# EAGLE design TMC2660-test-with-grbl2 (EAGLE 7.5.0)

## Sheet 1 of 2
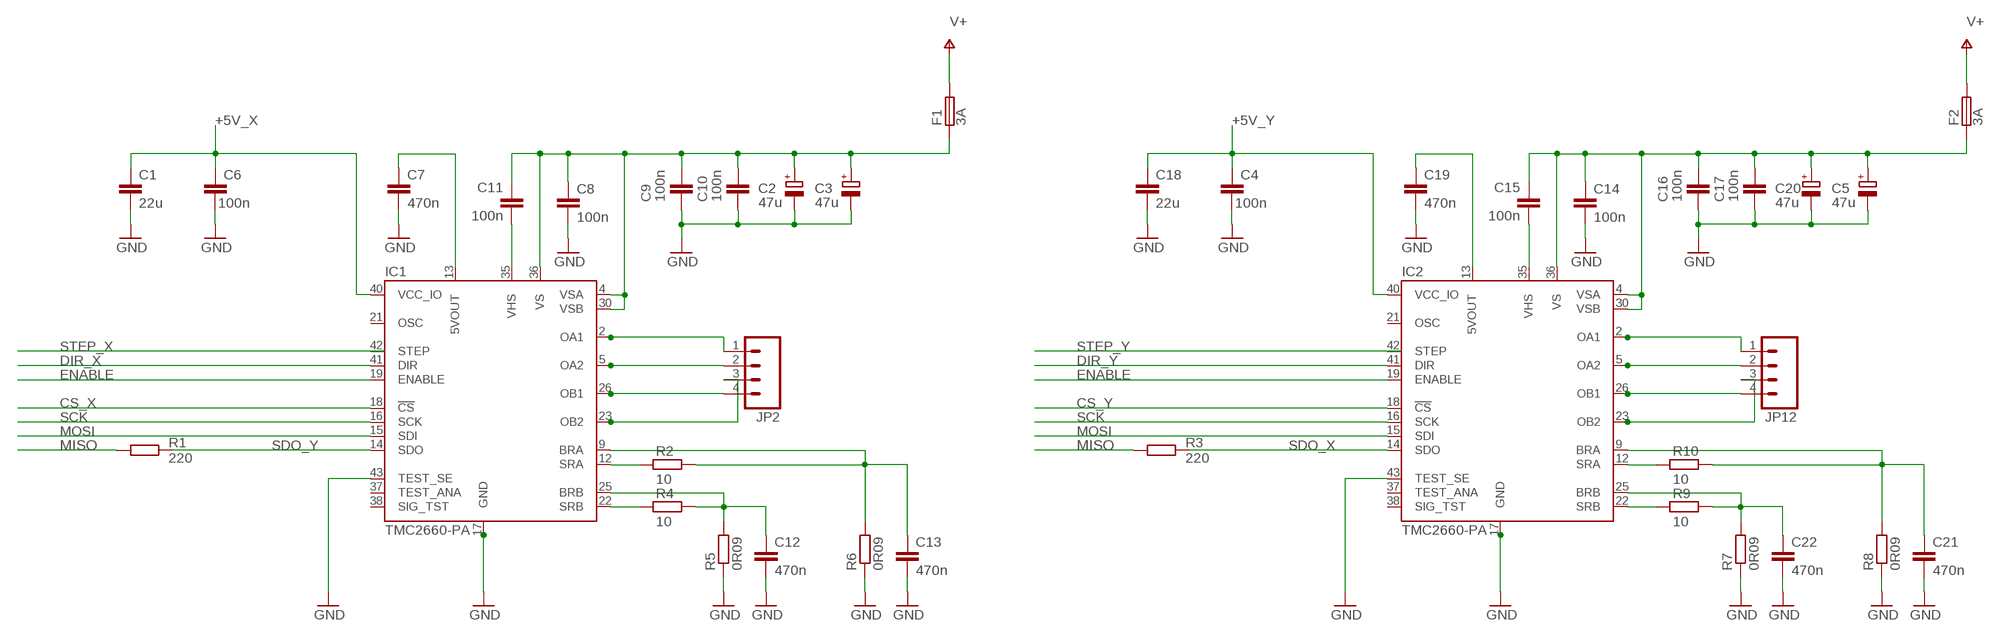
[diagram p0: schematic, sheet 1, part 1 of 2]
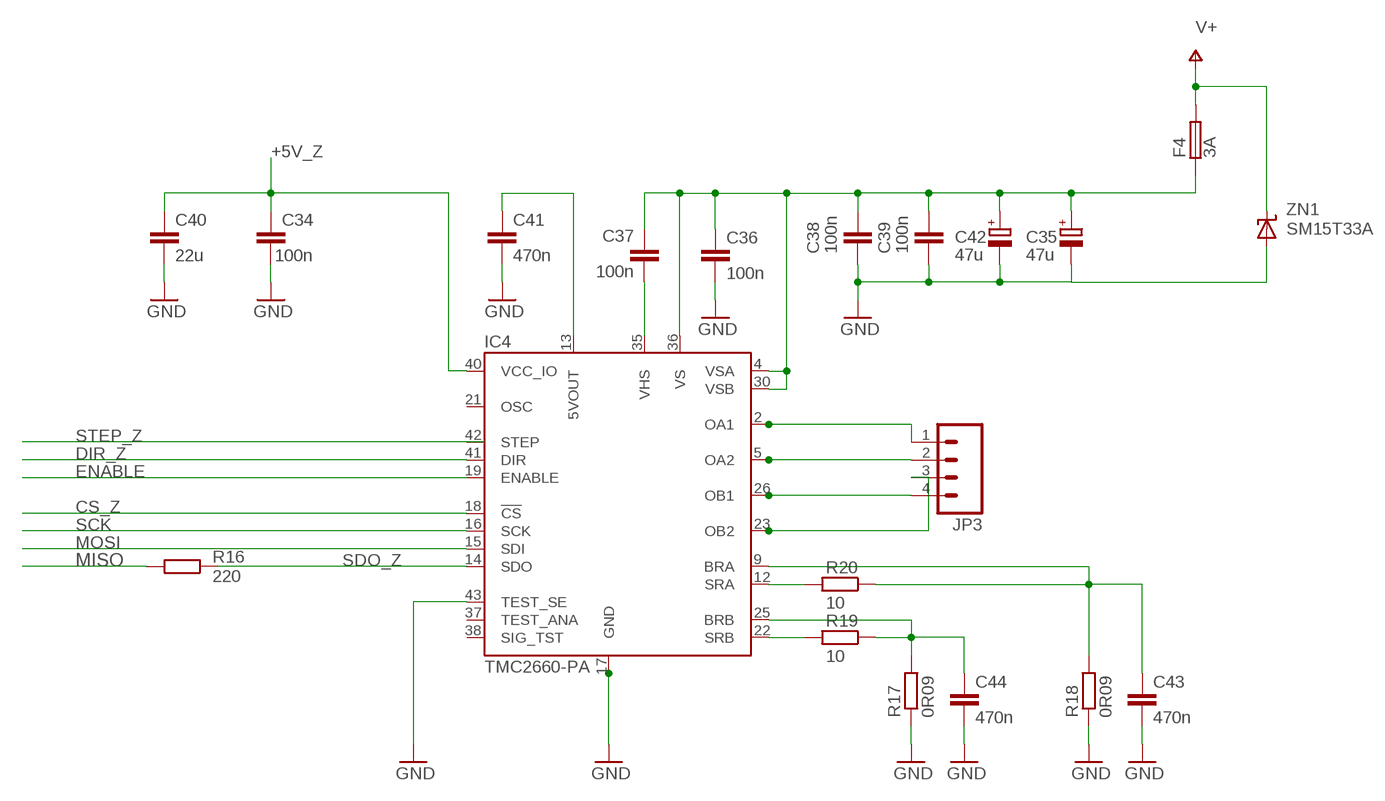
[diagram p1: schematic, sheet 1, part 2 of 2]

### Parts
C1  22u  C-EUC1206  [C1206]
C2  47u  CPOL-EUE5-8.5  [E5-8,5]
C3  47u  CPOL-EUE5-8.5  [E5-8,5]
C4  100n  C-EUC1206K  [C1206K]
C5  47u  CPOL-EUE5-8.5  [E5-8,5]
C6  100n  C-EUC1206K  [C1206K]
C7  470n  C-0805W  [0805-WIDE]
C8  100n  C-EUC0603K  [C0603K]
C9  100n  C-EUC0603K  [C0603K]
C10  100n  C-EUC0603K  [C0603K]
C11  100n  C-EUC0603K  [C0603K]
C12  470n  C-0805W  [0805-WIDE]
C13  470n  C-0805W  [0805-WIDE]
C14  100n  C-EUC0603K  [C0603K]
C15  100n  C-EUC0603K  [C0603K]
C16  100n  C-EUC0603K  [C0603K]
C17  100n  C-EUC0603K  [C0603K]
C18  22u  C-EUC1206  [C1206]
C19  470n  C-0805W  [0805-WIDE]
C20  47u  CPOL-EUE5-8.5  [E5-8,5]
C21  470n  C-0805W  [0805-WIDE]
C22  470n  C-0805W  [0805-WIDE]
C34  100n  C-EUC1206K  [C1206K]
C35  47u  CPOL-EUE5-8.5  [E5-8,5]
C36  100n  C-EUC0603K  [C0603K]
C37  100n  C-EUC0603K  [C0603K]
C38  100n  C-EUC0603K  [C0603K]
C39  100n  C-EUC0603K  [C0603K]
C40  22u  C-EUC1206  [C1206]
C41  470n  C-0805W  [0805-WIDE]
C42  47u  CPOL-EUE5-8.5  [E5-8,5]
C43  470n  C-0805W  [0805-WIDE]
C44  470n  C-0805W  [0805-WIDE]
F1  3A  AF2-FUSE_AF  [AF2]
F2  3A  AF2-FUSE_AF  [AF2]
F4  3A  AF2-FUSE_AF  [AF2]
IC1  TMC2660-PA  [PQFP44]
IC2  TMC2660-PA  [PQFP44]
IC4  TMC2660-PA  [PQFP44]
JP2  M04SCREW  [SCREWTERMINAL-3.5MM-4]
JP3  M04SCREW  [SCREWTERMINAL-3.5MM-4]
JP12  M04SCREW  [SCREWTERMINAL-3.5MM-4]
R1  220  R-EU_R0603  [R0603]
R2  10  R-EU_R0603  [R0603]
R3  220  R-EU_R0603  [R0603]
R4  10  R-EU_R0603  [R0603]
R5  0R09  R-EU_R1206  [R1206]
R6  0R09  R-EU_R1206  [R1206]
R7  0R09  R-EU_R1206  [R1206]
R8  0R09  R-EU_R1206  [R1206]
R9  10  R-EU_R0603  [R0603]
R10  10  R-EU_R0603  [R0603]
R16  220  R-EU_R0603  [R0603]
R17  0R09  R-EU_R1206  [R1206]
R18  0R09  R-EU_R1206  [R1206]
R19  10  R-EU_R0603  [R0603]
R20  10  R-EU_R0603  [R0603]
ZN1  SM15T33A  D-ZN_SMC  [SMC]

### Nets
+5V_X: C1.1 C6.2 IC1.40(VCC_IO)
+5V_Y: C4.2 C18.1 IC2.40(VCC_IO)
+5V_Z: C34.2 C40.1 IC4.40(VCC_IO)
CS_X: IC1.18(!CS) ; also sheet 2
CS_Y: IC2.18(!CS) ; also sheet 2
CS_Z: IC4.18(!CS) ; also sheet 2
DIR_X: IC1.41(DIR) ; also sheet 2
DIR_Y: IC2.41(DIR) ; also sheet 2
DIR_Z: IC4.41(DIR) ; also sheet 2
ENABLE: IC1.19(ENABLE) IC2.19(ENABLE) IC4.19(ENABLE)
GND: C1.2 C2.- C3.- C4.1 C5.- C6.1 C7.2 C8.2 C9.1 C10.1 C12.2 C13.2 C14.2 C16.1 C17.1 C18.2 C19.2 C20.- C21.2 C22.2 C34.1 C35.- C36.2 C38.1 C39.1 C40.2 C41.2 C42.- C43.2 C44.2 IC1.17(GND) IC1.39(GND1) IC1.43(TEST_SE) IC1.44(GND2) IC2.17(GND) IC2.39(GND1) IC2.43(TEST_SE) IC2.44(GND2) IC4.17(GND) IC4.39(GND1) IC4.43(TEST_SE) IC4.44(GND2) R5.1 R6.1 R7.1 R8.1 R17.1 R18.1 ZN1.P$2(A) ; also sheet 2
MISO: R1.2 R3.2 R16.2 ; also sheet 2
MOSI: IC1.15(SDI) IC2.15(SDI) IC4.15(SDI) ; also sheet 2
N$1: IC1.22(SRB) R4.2
N$2: C12.1 IC1.25(BRB) R4.1 R5.2
N$3: C13.1 IC1.9(BRA) R2.1 R6.2
N$4: IC1.12(SRA) R2.2
N$5: C22.1 IC2.25(BRB) R7.2 R9.1
N$6: C21.1 IC2.9(BRA) R8.2 R10.1
N$7: IC2.22(SRB) R9.2
N$8: IC2.12(SRA) R10.2
N$9: C44.1 IC4.25(BRB) R17.2 R19.1
N$10: C43.1 IC4.9(BRA) R18.2 R20.1
N$11: IC4.22(SRB) R19.2
N$12: IC4.12(SRA) R20.2
OA1: IC1.2(OA1) IC1.3(OA1_1) IC1.7(OA1_2) IC1.8(OA1_3) JP2.1
OA2: IC1.5(OA2) IC1.6(OA2_1) IC1.10(OA2_2) IC1.11(OA2_3) JP2.2
OA3: IC2.2(OA1) IC2.3(OA1_1) IC2.7(OA1_2) IC2.8(OA1_3) JP12.1
OA4: IC2.5(OA2) IC2.6(OA2_1) IC2.10(OA2_2) IC2.11(OA2_3) JP12.2
OA5: IC4.2(OA1) IC4.3(OA1_1) IC4.7(OA1_2) IC4.8(OA1_3) JP3.1
OA6: IC4.5(OA2) IC4.6(OA2_1) IC4.10(OA2_2) IC4.11(OA2_3) JP3.2
OB1: IC1.26(OB1) IC1.27(OB1_1) IC1.31(OB1_2) IC1.32(OB1_3) JP2.4
OB2: IC1.23(OB2) IC1.24(OB2_1) IC1.28(OB2_2) IC1.29(OB2_3) JP2.3
OB3: IC2.23(OB2) IC2.24(OB2_1) IC2.28(OB2_2) IC2.29(OB2_3) JP12.3
OB4: IC2.26(OB1) IC2.27(OB1_1) IC2.31(OB1_2) IC2.32(OB1_3) JP12.4
OB5: IC4.23(OB2) IC4.24(OB2_1) IC4.28(OB2_2) IC4.29(OB2_3) JP3.3
OB6: IC4.26(OB1) IC4.27(OB1_1) IC4.31(OB1_2) IC4.32(OB1_3) JP3.4
PWR_X: C2.+ C3.+ C8.1 C9.2 C10.2 C11.2 F1.P$1 IC1.4(VSA) IC1.30(VSB) IC1.36(VS)
PWR_Y: C5.+ C14.1 C15.2 C16.2 C17.2 C20.+ F2.P$1 IC2.4(VSA) IC2.30(VSB) IC2.36(VS)
PWR_Z: C35.+ C36.1 C37.2 C38.2 C39.2 C42.+ F4.P$1 IC4.4(VSA) IC4.30(VSB) IC4.36(VS)
SCK: IC1.16(SCK) IC2.16(SCK) IC4.16(SCK) ; also sheet 2
SDO_X: IC2.14(SDO) R3.1
SDO_Y: IC1.14(SDO) R1.1
SDO_Z: IC4.14(SDO) R16.1
STEP_X: IC1.42(STEP) ; also sheet 2
STEP_Y: IC2.42(STEP) ; also sheet 2
STEP_Z: IC4.42(STEP) ; also sheet 2
V+: F1.P$2 F2.P$2 F4.P$2 ZN1.P$1(C) ; also sheet 2
VHS: C11.1 IC1.35(VHS)
VHS1: C15.1 IC2.35(VHS)
VHS2: C37.1 IC4.35(VHS)
VREG: C7.1 IC1.13(5VOUT)
VREG1: C19.1 IC2.13(5VOUT)
VREG2: C41.1 IC4.13(5VOUT)
Unconnected: IC1.21(OSC) IC1.37(TEST_ANA) IC1.38(SIG_TST) IC2.21(OSC) IC2.37(TEST_ANA) IC2.38(SIG_TST) IC4.21(OSC) IC4.37(TEST_ANA) IC4.38(SIG_TST)

## Sheet 2 of 2
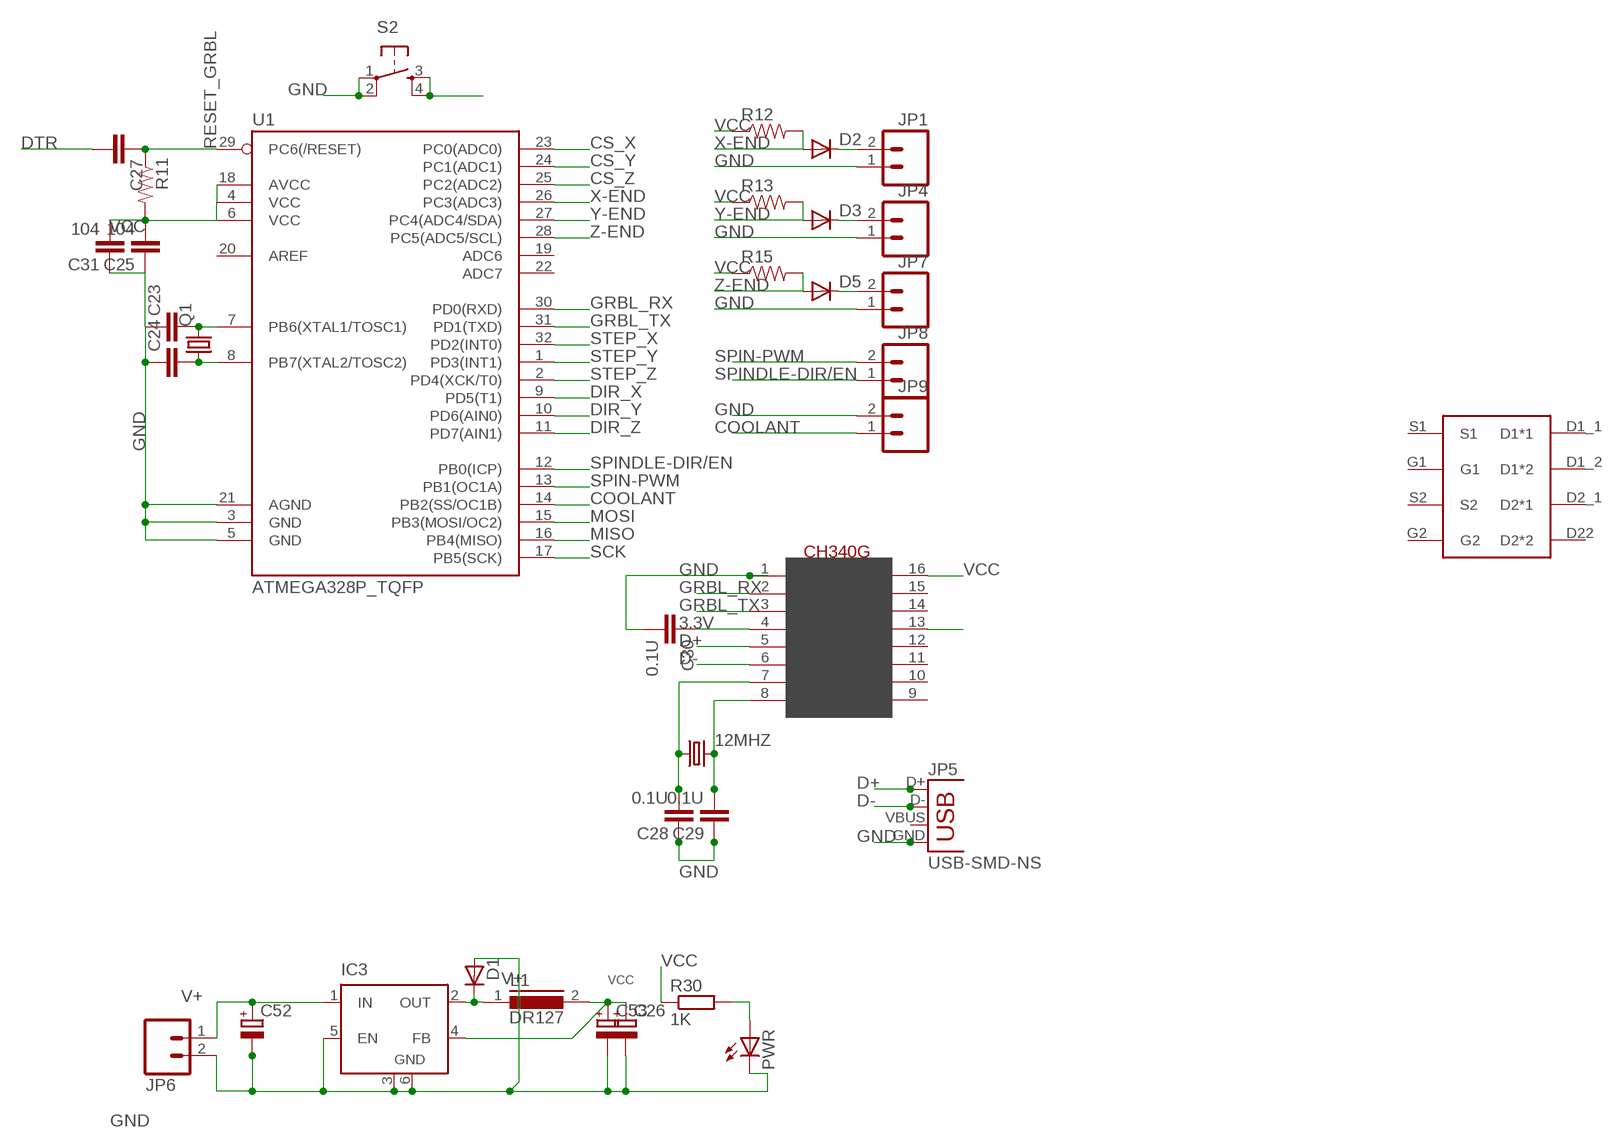
[diagram p2: schematic, sheet 2]

### Parts
12MHZ  CRYSTALHC49UP  [HC49UP]
C23  CAP1206  [1206]
C24  CAP1206  [1206]
C25  104  CAP1206  [1206]
C26  CPOL-EUE2.5-6  [E2,5-6]
C27  CAP1206  [1206]
C28  0.1U  C-EUC1206  [C1206]
C29  0.1U  C-EUC1206  [C1206]
C30  0.1U  C-EUC1206  [C1206]
C31  104  CAP1206  [1206]
C52  CPOL-EUE5-8.5  [E5-8,5]
C53  CPOL-EUE5-8.5  [E5-8,5]
D1  D-SOD-80  [SOD80]
D2  DIODESMB  [SMB-DIODE]
D3  DIODESMB  [SMB-DIODE]
D5  DIODESMB  [SMB-DIODE]
IC3  LM2596S  [TO263-5]
JP1  M023.5MM  [SCREWTERMINAL-3.5MM-2]
JP4  M023.5MM  [SCREWTERMINAL-3.5MM-2]
JP5  USB-SMD-NS  [USB-MINIB-NOSTOP]
JP6  M023.5MM  [SCREWTERMINAL-3.5MM-2]
JP7  M023.5MM  [SCREWTERMINAL-3.5MM-2]
JP8  M023.5MM  [SCREWTERMINAL-3.5MM-2]
JP9  M023.5MM  [SCREWTERMINAL-3.5MM-2]
L1  DR127  [DR127]
PWR  LEDCHIPLED_1206  [CHIPLED_1206]
Q1  CRYSTALHC49UP  [HC49UP]
R11  RESISTOR1206  [1206]
R12  RESISTOR1206  [1206]
R13  RESISTOR1206  [1206]
R15  RESISTOR1206  [1206]
R30  1K  R-EU_M1206  [M1206]
S2  TAC_SWITCHSMD  [TACTILE_SWITCH_SMD]
U1  ATMEGA328P_TQFP  [TQFP32-08]
U$3  CSD88537ND  [CSD88537ND]
U$4  CH340G  [SOIC16]

### Nets
3.3V: C30.1 U$4.4(V3)
COOLANT: JP9.1 U1.14(PB2(SS/OC1B))
CS_X: U1.23(PC0(ADC0)) ; also sheet 1
CS_Y: U1.24(PC1(ADC1)) ; also sheet 1
CS_Z: U1.25(PC2(ADC2)) ; also sheet 1
D+: JP5.D+ U$4.5(D+)
D-: JP5.D- U$4.6(D-)
DIR_X: U1.9(PD5(T1)) ; also sheet 1
DIR_Y: U1.10(PD6(AIN0)) ; also sheet 1
DIR_Z: U1.11(PD7(AIN1)) ; also sheet 1
DTR: C27.2 U$4.13(DTR)
GND: C23.1 C24.1 C25.1 C26.- C28.1 C29.1 C30.2 C31.1 C52.- C53.- D1.2(A) IC3.3(GND) IC3.5(EN) IC3.6(GND) JP1.1 JP4.1 JP5.GND JP6.2 JP7.1 JP9.2 PWR.C S2.1 S2.2 U1.3(GND) U1.5(GND) U1.21(AGND) U$4.1(GND) ; also sheet 1
GRBL_RX: U1.30(PD0(RXD)) U$4.2(TX)
GRBL_TX: U1.31(PD1(TXD)) U$4.3(RX)
MISO: U1.16(PB4(MISO)) ; also sheet 1
MOSI: U1.15(PB3(MOSI/OC2)) ; also sheet 1
N$13: C23.2 Q1.2 U1.7(PB6(XTAL1/TOSC1))
N$14: C24.2 Q1.1 U1.8(PB7(XTAL2/TOSC2))
N$15: D2.C JP1.2
N$16: D3.C JP4.2
N$17: 12MHZ.1 C28.2 U$4.7(XI)
N$18: D5.C JP7.2
N$19: 12MHZ.2 C29.2 U$4.8(XO)
N$45: D1.1(C) IC3.2(OUT) L1.1
N$47: PWR.A R30.2
RESET_GRBL: C27.1 R11.1 S2.3 S2.4 U1.29(PC6(/RESET))
SCK: U1.17(PB5(SCK)) ; also sheet 1
SPIN-PWM: JP8.2 U1.13(PB1(OC1A))
SPINDLE-DIR/EN: JP8.1 U1.12(PB0(ICP))
STEP_X: U1.32(PD2(INT0)) ; also sheet 1
STEP_Y: U1.1(PD3(INT1)) ; also sheet 1
STEP_Z: U1.2(PD4(XCK/T0)) ; also sheet 1
V+: C52.+ IC3.1(IN) JP6.1 ; also sheet 1
VCC: C25.2 C26.+ C31.2 C53.+ IC3.4(FB) L1.2 R11.2 R12.1 R13.1 R15.1 R30.1 U1.4(VCC) U1.6(VCC) U1.18(AVCC) U$4.16(VCC)
X-END: D2.A R12.2 U1.26(PC3(ADC3))
Y-END: D3.A R13.2 U1.27(PC4(ADC4/SDA))
Z-END: D5.A R15.2 U1.28(PC5(ADC5/SCL))
Unconnected: JP5.VBUS U1.19(ADC6) U1.20(AREF) U1.22(ADC7) U$4.9(CTS) U$4.10(DSR) U$4.11(RI) U$4.12(DCD) U$4.14(RTS) U$4.15(RS232)

## Power pins joined to a net without a drawn wire
D1*1: U$3.D1_1(D1*1)
D1*2: U$3.D1_2(D1*2)
D2*1: U$3.D2_1(D2*1)
D2*2: U$3.D22(D2*2)
G1: U$3.G1
G2: U$3.G2
S1: U$3.S1
S2: U$3.S2

## Library data of the parts
12MHZ = crystal:CRYSTAL: CRYSTAL; OC_FARNELL: unknown; OC_NEWARK: unknown
C1 C18 C40 = rcl:C-EU: CAPACITOR, European symbol; MANUFACTURER: Taiyo Yuden; PARTNR: JMK316B7226ML-T; TYPE: X7R; VOLTAGE: 6.3V
C2 C3 C5 C20 C35 C42 = rcl:CPOL-EU: POLARIZED CAPACITOR, European symbol; MANUFACTURER: PANASONIC; PARTNR: EEEFK1H470XP; VOLTAGE: 50V
C4 C6 C34 = rcl:C-EU: CAPACITOR, European symbol; MANUFACTURER: Kemet; PARTNR: C0603C104K3RACTU; TYPE: X7R; VOLTAGE: 25V
C7 C12 C13 C19 C21 C22 C41 C43 C44 = 07_eigene_RLC:C; MANUFACTURER: Vishay; PARTNR: VJ0805Y474KXQTW1BC; TYPE: X7R; VOLTAGE: 10V
C8-C11 C14-C17 C36-C39 = rcl:C-EU: CAPACITOR, European symbol; MANUFACTURER: Kemet; PARTNR: C0603C104K5RACTU; TYPE: X7R; VOLTAGE: 50V
C23-C25 C27 C31 = SparkFun-Capacitors:CAP: Capacitor Standard 0603 ceramic capacitor, and 0.1" leaded capacitor.
C26 C52 C53 = resistor:CPOL-EU: POLARIZED CAPACITOR, European symbol
C28-C30 = rcl:C-EU: CAPACITOR, European symbol
D1 = semicon-smd-ipc:D-: DIODE unfilled
D2 D3 D5 = SparkFun-DiscreteSemi:DIODE: Diode These are standard reverse protection diodes and small signal diodes. SMA package can handle up to about 1A. SOD-323 can handle about 200mA. What the SOD-323 package when ordering, there are some mfgs out there that are 5-pin packages.
F1 F2 F4 = 02_eigene:AF2-FUSE: AF2 Very Fast Acting Surface Mount Fuses Konrad Meyer (c) 2011 Very fast acting at 200% overload current levels ? Excellent inrush current withstanding capability ? Fiberglass enforced epoxy fuse body ? Copper or copper alloy composite fuse link ? Copper termination with nickel and tin plating ? Halogen free, RoHS compliant and 100% lead-free ? Operating temperature range: -55°C to +125 °C (with de-rating) www.aem-usa.com; MANUFACTURER: Cooper Bussman; PARTNR: CB61F3A-TR2; VOLTAGE: 125V
IC1 IC2 IC4 = 001_ICs:TMC2660: Stepper Driver TMC2660; MANUFACTURER: TRINAMIC; PARTNR: TMC2660
IC3 = linear:LM2596S: STEP-DOWN VOLTAGE REGULATOR
JP1 JP4 JP6-JP9 = SparkFun-Connectors:M02: Standard 2-pin 0.1" header. Use with - straight break away headers ( PRT-00116) - right angle break away headers (PRT-00553) - swiss pins (PRT-00743) - machine pins (PRT-00117) - female headers (PRT-00115) Molex polarized connector foot print use with: PRT-08233 with associated crimp pins and housings. 2.54_SCREWTERM for use with PRT-10571. 3.5mm Screw Terminal footprints for PRT-08084 5mm Screw Terminal footprints for use with PRT-08432; PROD_ID: CONN-08399
JP2 JP3 JP12 = SparkFun-Connectors:M04: Header 4 Standard 4-pin 0.1" header. Use with straight break away headers (SKU : PRT-00116), right angle break away headers (PRT-00553), swiss pins (PRT-00743), machine pins (PRT-00117), and female headers (PRT-00115). Molex polarized connector foot print use with SKU : PRT-08231 with associated crimp pins and housings. 1MM SMD Version SKU: PRT-10208; PROD_ID: Combine 2x8399
JP5 = SparkFun-Connectors:USB: USB Connectors USB-B-PTH is fully proven SKU : PRT-00139/CONN-08278 USB-miniB is fully proven SKU : PRT-00587 USB-A-PCB is untested. USB-A-H is throughly reviewed, but untested. Spark Fun Electronics SKU : PRT-00437 USB-B-SMT is throughly reviewed, but untested. Needs silkscreen touching up. USB-A-S has not been used/tested USB-MB-H has not been used/tested USB-MICROB has been used. CONN-09505
L1 = inductors:DR127: High Power Density, High Efficiency, Shielded Inductors Source: coiltronics_dr_series.pdf
PWR = RepRapjr:LED: LED OSRAM: - CHIPLED LG R971, LG N971, LY N971, LG Q971, LY Q971, LO R971, LY R971 LH N974, LH R974 LS Q976, LO Q976, LY Q976 LO Q996 - Hyper CHIPLED LW Q18S LB Q993, LB Q99A, LB R99A - SideLED LS A670, LO A670, LY A670, LG A670, LP A670 LB A673, LV A673, LT A673, LW A673 LH A674 LY A675 LS A676, LA A676, LO A676, LY A676, LW A676 LS A679, LY A679, LG A679 - Hyper Micro SIDELED® LS Y876, LA Y876, LO Y876, LY Y876 LT Y87S - SmartLED LW L88C, LW L88S LB L89C, LB L89S, LG L890 LS L89K, LO L89K, LY L89K LS L896, LA L896, LO L896, LY L896 - TOPLED LS T670, LO T670, LY T670, LG T670, LP T670 LSG T670, LSP T670, LSY T670, LOP T670, LYG T670 LG T671, LOG T671, LSG T671 LB T673, LV T673, LT T673, LW T673 LH T674 LS T676, LA T676, LO T676, LY T676, LB T676, LH T676, LSB T676, LW T676 LB T67C, LV T67C, LT T67C, LS T67K, LO T67K, LY T67K, LW E67C LS E67B, LA E67B, LO E67B, LY E67B, LB E67C, LV E67C, LT E67C LW T67C LS T679, LY T679, LG T679 LS T770, LO T770, LY T770, LG T770, LP T770 LB T773, LV T773, LT T773, LW T773 LH T774 LS E675, LA E675, LY E675, LS T675 LS T776, LA T776, LO T776, LY T776, LB T776 LHGB T686 LT T68C, LB T68C - Hyper Mini TOPLED® LB M676 - Mini TOPLED Santana® LG M470 LS M47K, LO M47K, LY M47K Source: http://www.osram.convergy.de LUXEON: - LUMILED® LXK2-PW12-R00, LXK2-PW12-S00, LXK2-PW14-U00, LXK2-PW14-V00 LXK2-PM12-R00, LXK2-PM12-S00, LXK2-PM14-U00 LXK2-PE12-Q00, LXK2-PE12-R00, LXK2-PE12-S00, LXK2-PE14-T00, LXK2-PE14-U00 LXK2-PB12-K00, LXK2-PB12-L00, LXK2-PB12-M00, LXK2-PB14-N00, LXK2-PB14-P00, LXK2-PB14-Q00 LXK2-PR12-L00, LXK2-PR12-M00, LXK2-PR14-Q00, LXK2-PR14-R00 LXK2-PD12-Q00, LXK2-PD12-R00, LXK2-PD12-S00 LXK2-PH12-R00, LXK2-PH12-S00 LXK2-PL12-P00, LXK2-PL12-Q00, LXK2-PL12-R00 Source: www.luxeon.com KINGBRIGHT: KA-3528ASYC Source: www.kingbright.com
Q1 = adafruit:CRYSTAL: CRYSTAL; OC_FARNELL: unknown; OC_NEWARK: unknown
R1 R3 R16 = rcl:R-EU_: RESISTOR, European symbol; MANUFACTURER: KOA Speer; PARTNR: SG73S1JTTD221J
R2 R4 R9 R10 R19 R20 = rcl:R-EU_: RESISTOR, European symbol; MANUFACTURER: KOA Speer; PARTNR: RN73H1JTTD10R0F100
R5-R8 R17 R18 = rcl:R-EU_: RESISTOR, European symbol; MANUFACTURER: Panasonic; PARTNR: ERJ-B2CFR091V; POWER: 0.75W
R11-R13 R15 = SparkFun-Passives:RESISTOR: Resistor Basic schematic elements and footprints for 0603, 1206, and PTH resistors.
R30 = rcl:R-EU_: RESISTOR, European symbol
S2 = SparkFun:TAC_SWITCH: Momentary Switch Button commonly used for reset or general input. Spark Fun Electronics SKU : COM-00097
U1 = SparkFun-DigitalIC:ATMEGA328P_TQFP; PROD_ID: IC-09069
U$3 = tidrv8711:CSD88537ND
U$4 = usb-serial:CH340G
ZN1 = 08_Diskret:D-ZN: SM15T - Transil(TM) refer to datasheet for e.g. SM15T36A; MANUFACTURER: ST; PARTNR: SM15T33A; PLACED: NO

## Board
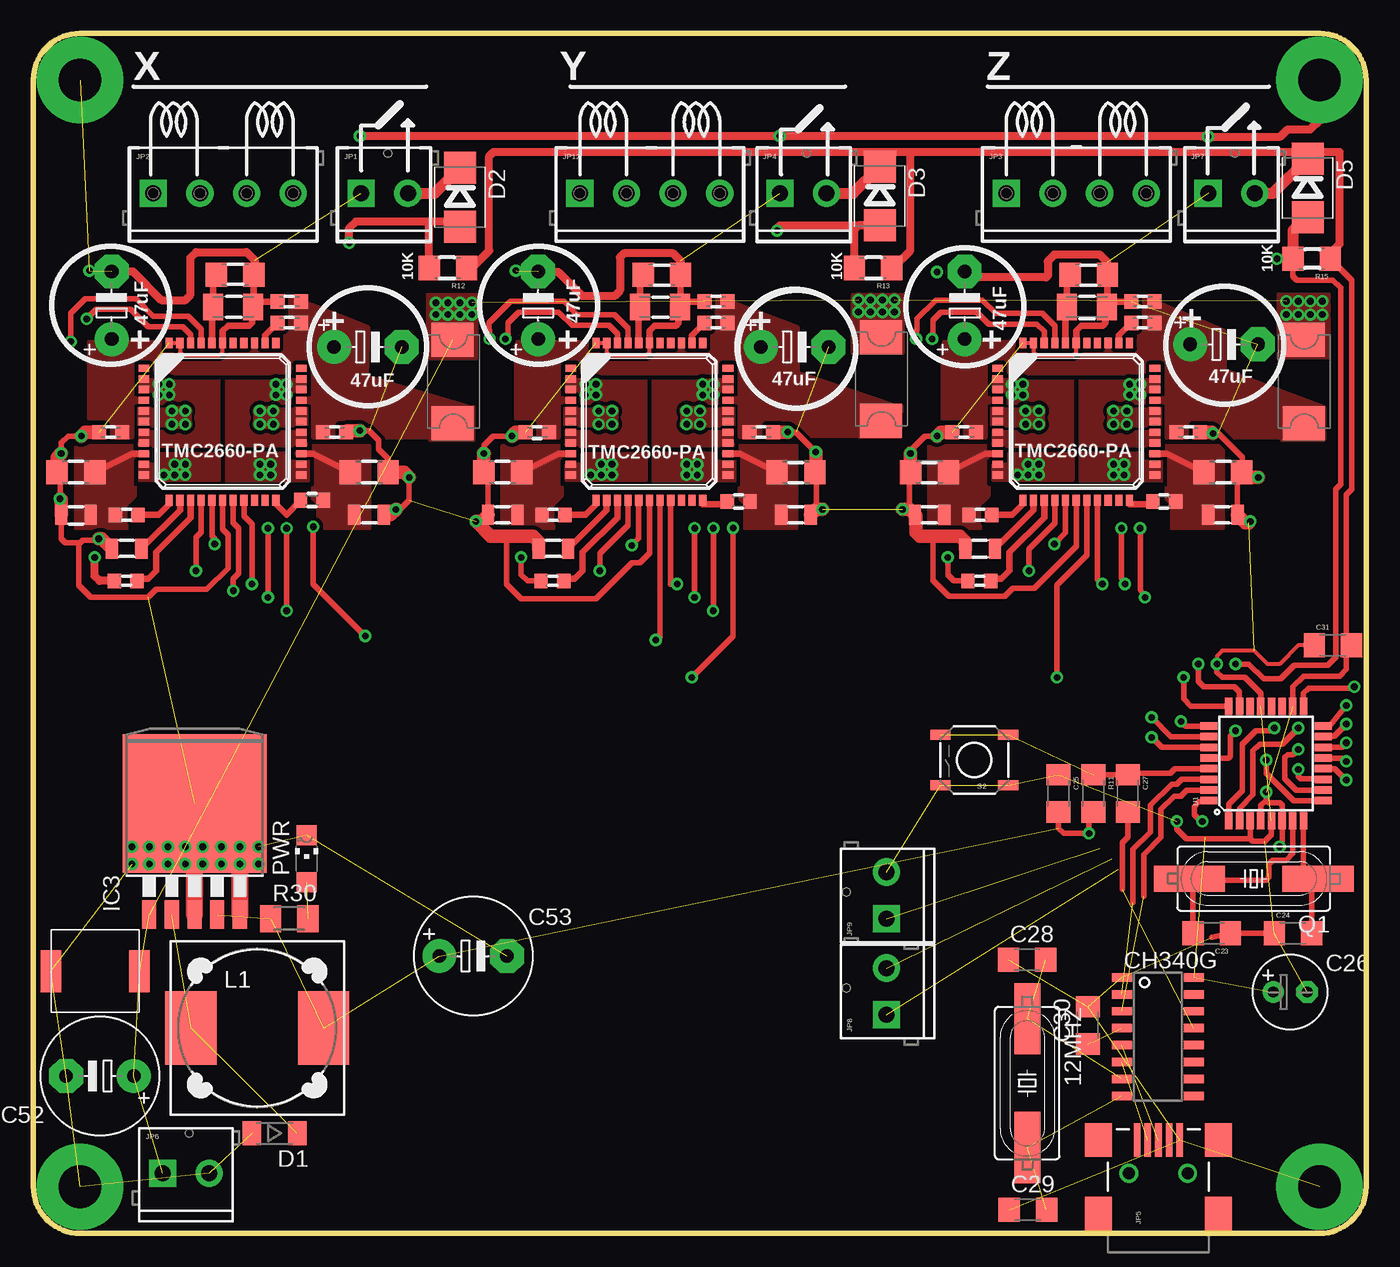
[diagram p3: board, top side]
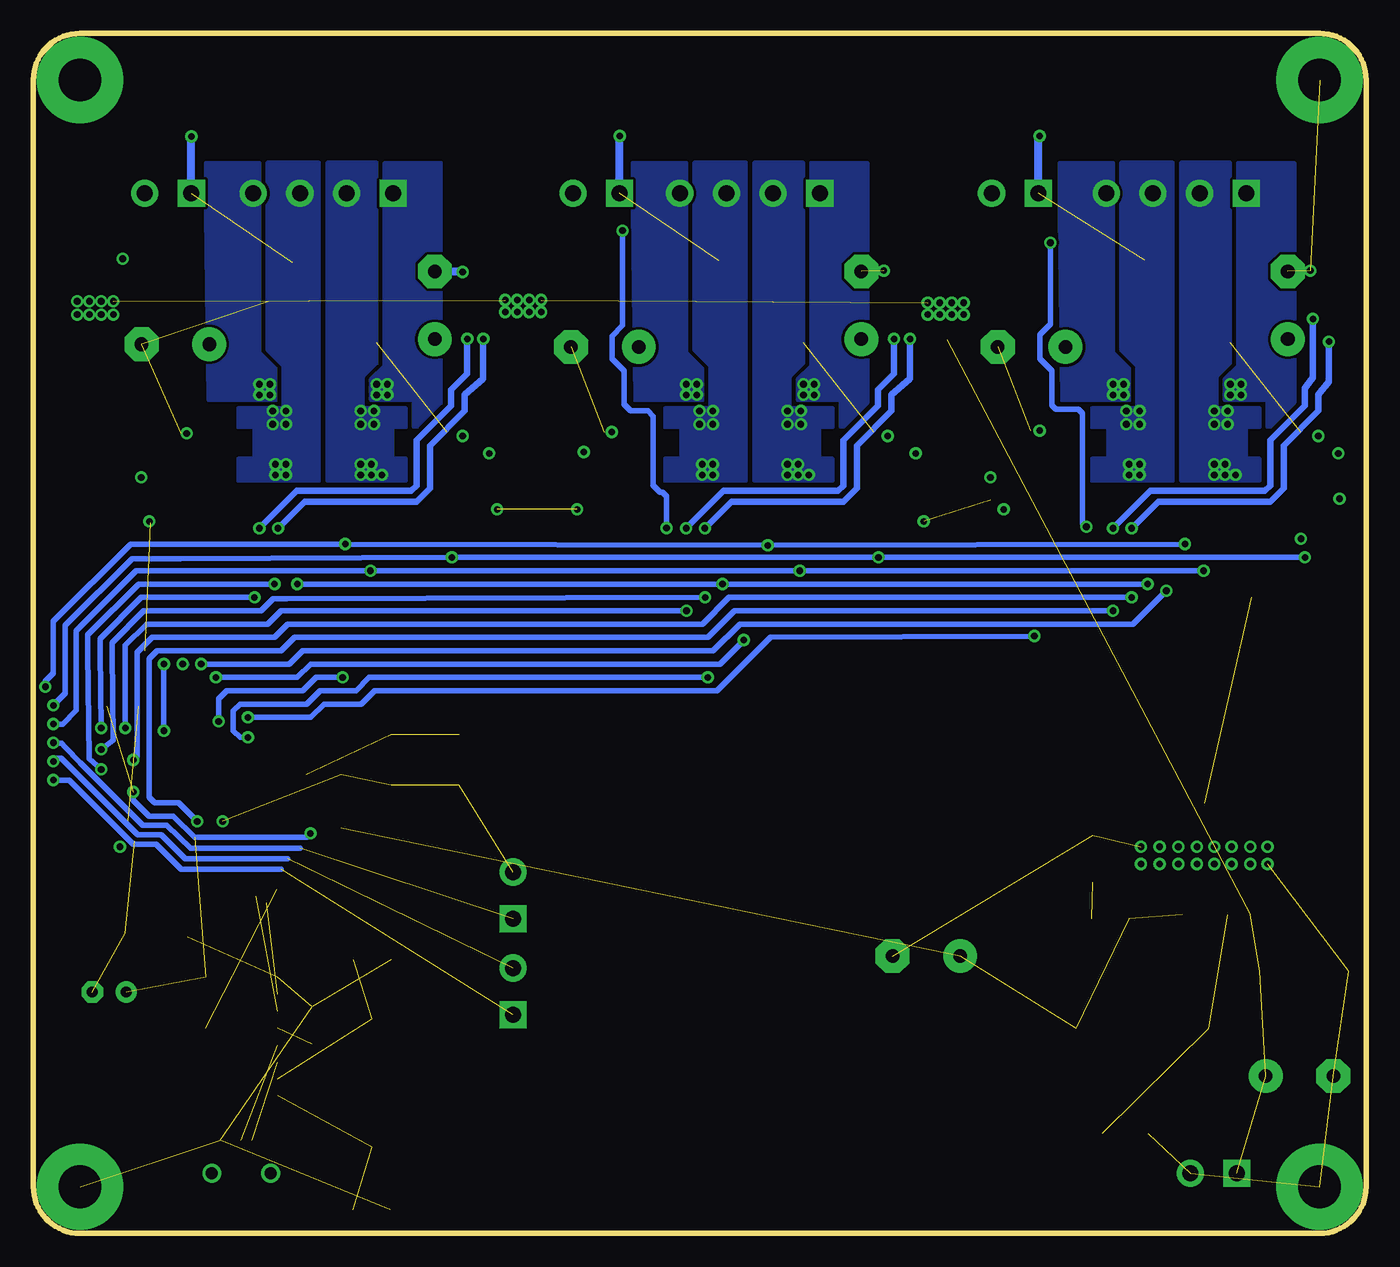
[diagram p4: board, bottom side, seen from below]

Size 100 x 90 mm. Coordinates in mm from the lower left corner, seen from the top.
Outline: 0,3.5 0,86.5 arc-90 3.5,90 96.5,90 arc-90 100,86.5 100,3.5 arc-90 96.5,0 3.5,0 arc-90 0,3.5
Copper layers (1*16): Top 0.035mm / dielectric 1.5mm / Bottom 0.035mm
Design rules "default": minimum track width 10mil, minimum drill 24mil, track to track 8mil, track to pad 8mil, pad to pad 8mil, via to via 8mil, smd to smd 8mil, copper to edge 40mil, drill to drill 8mil, minimum pad ring 10mil, minimum via ring 8mil, stop-mask expansion 4mil, vias tented up to drill 0mil, thermal gap 10mil

### Footprints (pad centres in the part's own frame; a part is rotated, then mirrored left to right if it is on the bottom)
HC49UP = smd 5.334 x 1.93: 1 -4.826,0; 2 4.826,0
C1206 = smd 1.6 x 1.8: 1 -1.4,0; 2 1.4,0
E5-8,5 = drill 1.016 pad 2.54: + -2.54,0 | drill 1.016 pad 2.54 octagon: - 2.54,0
C1206K = smd 1.5 x 2: 1 -1.5,0; 2 1.5,0
0805-WIDE = smd 0.919 x 1.5: 1 -1.104,0; 2 1.104,0
C0603K = smd 1.05 x 1.08: 1 -0.875,0; 2 0.875,0
1206 = smd 1.6 x 1.8: 1 -1.4,0; 2 1.4,0
E2,5-6 = drill 0.813 pad 1.6: + -1.27,0 | drill 0.813 pad 1.6 octagon: - 1.27,0
SOD80 = smd 1.4 x 1.8: 1 -1.7,0; 2 1.7,0
SMB-DIODE = smd 2.4 x 2.4: A 2.2,0; C -2.2,0
AF2 = smd 2.54 x 3.15: P$1 -3.132,0; P$2 3.132,0
PQFP44 = smd 0.54 x 0.8: 1 -4,-5.9; 2 -3.2,-5.9; 3 -2.4,-5.9; 4 -1.6,-5.9; 5 -0.8,-5.9; 6 0,-5.9; 7 0.8,-5.9; 8 1.6,-5.9; 9 2.4,-5.9; 10 3.2,-5.9; 11 4,-5.9; 23 4,5.9; 24 3.2,5.9; 25 2.4,5.9; 26 1.6,5.9; 27 0.8,5.9; 28 0,5.9; 29 -0.8,5.9; 30 -1.6,5.9; 31 -2.4,5.9; 32 -3.2,5.9; 33 -4,5.9 | smd 0.8 x 0.54: 12 5.9,-4; 13 5.9,-3.2; 14 5.9,-2.4; 15 5.9,-1.6; 16 5.9,-0.8; 17 5.9,0; 18 5.9,0.8; 19 5.9,1.6; 20 5.9,2.4; 21 5.9,3.2; 22 5.9,4; 34 -5.9,4; 35 -5.9,3.2; 36 -5.9,2.4; 37 -5.9,1.6; 38 -5.9,0.8; 39 -5.9,0; 40 -5.9,-0.8; 41 -5.9,-1.6; 42 -5.9,-2.4; 43 -5.9,-3.2; 44 -5.9,-4
TO263-5 = smd 1.067 x 2.159: 1 -3.404,-5.791; 2 -1.702,-5.791; 3 0,-5.791; 4 1.702,-5.791; 5 3.404,-5.791 | smd 10.8 x 10.41: 6 0,2.54
SCREWTERMINAL-3.5MM-2 = drill 1.2 pad 2.032 square: 1 0,0 | drill 1.2 pad 2.032: 2 3.5,0
SCREWTERMINAL-3.5MM-4 = drill 1.2 pad 2.032 square: 1 0,0 | drill 1.2 pad 2.032: 2 3.5,0; 3 7,0; 4 10.5,0
USB-MINIB-NOSTOP = smd 2.5 x 0.5: D+ 2.5,0; D- 2.5,0.8; GND 2.5,-1.6; ID 2.5,-0.8; VBUS 2.5,1.6 | smd 2.5 x 2: G1 -3,-4.5; G2 -3,4.5; G3 2.5,4.5; G4 2.5,-4.5 | drill 0.9 pad 0.8: H1 0,2.2 | drill 0.9 pad 0.787: H2 0,-2.2
DR127 = smd 3.85 x 5.5: 1 -4.975,0; 2 4.975,0
CHIPLED_1206 = smd 1.5 x 1.5: A 0,-1.75; C 0,1.75
R0603 = smd 1 x 1.1: 1 -0.85,0; 2 0.85,0
R1206 = smd 1.6 x 1.803: 1 -1.422,0; 2 1.422,0
M1206 = smd 1.6 x 2: 1 -1.4,0; 2 1.4,0
TACTILE_SWITCH_SMD = smd 1.524 x 0.762: 1 -2.54,1.905; 2 2.54,1.905; 3 -2.54,-1.905; 4 2.54,-1.905
TQFP32-08 = smd 1.27 x 0.559: 1 -4.293,2.8; 2 -4.293,2; 3 -4.293,1.2; 4 -4.293,0.4; 5 -4.293,-0.4; 6 -4.293,-1.2; 7 -4.293,-2; 8 -4.293,-2.8; 17 4.293,-2.8; 18 4.293,-2; 19 4.293,-1.2; 20 4.293,-0.4; 21 4.293,0.4; 22 4.293,1.2; 23 4.293,2; 24 4.293,2.8 | smd 0.559 x 1.27: 9 -2.8,-4.293; 10 -2,-4.293; 11 -1.2,-4.293; 12 -0.4,-4.293; 13 0.4,-4.293; 14 1.2,-4.293; 15 2,-4.293; 16 2.8,-4.293; 25 2.8,4.293; 26 2,4.293; 27 1.2,4.293; 28 0.4,4.293; 29 -0.4,4.293; 30 -1.2,4.293; 31 -2,4.293; 32 -2.8,4.293
CSD88537ND = smd 0.6 x 2.2: D1_1 0.635,6.41; D1_2 1.905,6.41; D2_1 3.175,6.41; D22 4.445,6.41; G1 1.905,1.21; G2 4.445,1.21; S1 0.635,1.21; S2 3.175,1.21
SOIC16 = smd 0.635 x 1.524: 1 -4.445,-2.695; 2 -3.175,-2.695; 3 -1.905,-2.695; 4 -0.635,-2.695; 5 0.635,-2.695; 6 1.905,-2.695; 7 3.175,-2.695; 8 4.445,-2.695; 9 4.445,2.695; 10 3.175,2.695; 11 1.905,2.695; 12 0.635,2.695; 13 -0.635,2.695; 14 -1.905,2.695; 15 -3.175,2.695; 16 -4.445,2.695
SMC = smd 1.54 x 3.14: P$1 -3.33,0; P$2 3.33,0

### Placement (x,y rotation side)
12MHZ  74.57,11.27 270 top
C1  15.14,71.88 0 top
C2  25.1,66.48 0 top
C3  5.88,69.6 90 top
C4  47.02,69.48 180 top
C5  37.88,69.6 90 top
C6  15,69.48 180 top
C7  7,51.35 180 top
C8  5.8,60.08 180 top
C9  22.6,60.08 180 top
C10  19.2,69.88 0 top
C11  19.2,68.28 0 top
C12  25.2,53.88 0 top
C13  3.2,53.88 180 top
C14  37.82,60.08 180 top
C15  51.22,68.28 0 top
C16  54.62,60.08 180 top
C17  51.22,69.88 0 top
C18  47.16,71.88 0 top
C19  39.02,51.35 180 top
C20  57.12,66.48 0 top
C21  35.22,53.88 180 top
C22  57.22,53.88 0 top
C23  88.4,22.5 180 top
C24  94.5,22.5 0 top
C25  76.9,33 270 top
C26  94.3,18.1 0 top
C27  82.1,33 270 top
C28  74.56,20.52 0 top
C29  74.62,1.77 0 top
C30  79.1,15.6 90 top
C31  97.5,44.1 0 top
C34  79.04,69.48 180 top
C35  69.88,69.6 90 top
C36  69.84,60.08 180 top
C37  83.24,68.28 0 top
C38  86.64,60.08 180 top
C39  83.24,69.88 0 top
C40  79.18,71.88 0 top
C41  71.04,51.35 180 top
C42  89.34,66.68 0 top
C43  67.24,53.88 180 top
C44  89.24,53.88 0 top
C52  5,11.8 180 top
C53  33,20.8 0 top
D1  18.1,7.5 180 top
D2  32,77.7 270 top
D3  63.5,77.8 270 top
D5  95.6,78.4 270 top
F1  31.47,63.89 90 top
F2  63.59,64.09 90 top
F4  95.31,63.89 90 top
IC1  14.2,60.88 270 top
IC2  46.22,60.88 270 top
IC3  12.1,29.7 0 top
IC4  78.24,60.88 270 top
JP1  24.6,78 0 top
JP2  9,78 0 top
JP3  73,78 0 top
JP4  56.02,78 0 top
JP5  84.4,4.5 90 top
JP6  9.7,4.5 0 top
JP7  88.14,78 0 top
JP8  64,16.4 90 top
JP9  64,23.6 90 top
JP12  41,78 0 top
L1  16.8,15.4 0 top
PWR  20.5,28.1 0 top
Q1  91.56,26.6 180 top
R1  6.93,48.93 180 top
R2  7,53.88 0 top
R3  38.95,48.93 180 top
R4  20.9,54.98 180 top
R5  25.2,57.08 180 top
R6  3.2,57.08 0 top
R7  57.22,57.08 180 top
R8  35.22,57.08 0 top
R9  52.92,54.88 180 top
R10  39.02,53.88 0 top
R11  79.52,33 270 top
R12  31.1,72.4 180 top
R13  63,72.4 180 top
R15  95.9,73.1 180 top
R16  70.97,48.93 180 top
R17  89.24,57.08 180 top
R18  67.24,57.08 0 top
R19  84.84,54.88 180 top
R20  71.04,53.88 0 top
R30  19.2,23.6 0 top
S2  70.6,35.5 180 top
U1  92.49,35.25 90 top
U$3  -0.6,-15 0 top  (outside the outline)
U$4  84.37,14.75 270 top
ZN1  4.65,19.67 180 top

### Tracks (layer width: path | path; a pad name or v marks a point on that pad's centre or on a via)
3.3V  (1 unrouted)
+5V_X
  Top 0.5: IC1.40 13.4,69.38 C6.2 13.5,71.64 C1.1
+5V_Y
  Top 0.5: IC2.40 45.42,69.38 C4.2 45.52,71.64 C18.1
+5V_Z
  Top 0.5: IC4.40 77.44,69.38 C34.2 77.54,71.64 C40.1
COOLANT  (via drill 0.5 pad 0.25)  (1 unrouted)
  Top 0.406: U1.14 98.15,36.45 v98.5,36.8
  Bottom 0.406: 80,28.9 88.2,28.9 90,30.6 91.8,30.6 96.5,35.3 97.6,36.47 97.88,36.75 98.25,36.75 v98.5,36.8
CS_X  (via drill 0.5 pad 0.25)
  Top 0.406: IC1.18 15,53.3 15.4,52.9 15.4,49.5 15,49.1 v15,48.2 | 90.5,39.55 U1.23 90.49,40.61 90.1,41 87.8,41 87.4,41.4 v87.4,42.7
  Bottom 0.406: v15,48.2 17.5,45.7 47,45.7 49,43.7 79.8,43.7 80.8,42.7 v87.4,42.7
CS_Y  (via drill 0.5, 0.5 pad 0.25)
  Top 0.406: IC2.18 47.02,44.72 46.7,44.52 v46.7,44.5 | U1.24 86.86,39.54 86.3,40.1 v86.3,41.7
  Bottom 0.406: v46.7,44.5 48.5,42.7 79.2,42.7 80.2,41.7 v86.3,41.7
CS_Z  (via drill 0.5 pad 0.25)
  Top 0.406: IC4.18 79.04,50.84 76.8,48.6 v76.8,41.7 | U1.25 86.45,38.05 v86.1,38.4
  Bottom 0.406: v86.1,38.4 86.1,40.1 85.5,40.7 79.8,40.7 78.8,41.7 v76.8,41.7
D+  (1 unrouted)
D-  (1 unrouted)
DIR_X  (via drill 0.5 pad 0.25)
  Top 0.406: IC1.41 12.6,67.8 11.6,68.8 9,68.8 7.7,70.1 3.9,70.1 2.8,69 v2.8,66.88 | v17.6,52.88 v17.6,47.7 | U1.9 94.55,32.45 92.5,34.5 v92.5,35.5
  Bottom 0.406: v17.6,47.7 47.8,47.7 49.8,45.7 80.9,45.7 81.9,44.7 91.1,44.7 92.2,43.6 92.2,35.8 v92.5,35.5
  Bottom 0.5: v17.6,52.88 15.6,54.88 7.2,54.88 6.2,55.88 6.2,59.08 3.6,61.68 3.6,62.88 2.8,63.88 v2.8,66.88
DIR_Y  (via drill 0.5 pad 0.25)
  Top 0.406: 34.22,67.68 v34.22,67.08 34.2,67.1 34.2,68.3 35.8,69.9 39.8,69.9 40.8,68.9 43.6,68.9 44.62,67.88 IC2.41 | v49.62,52.88 49.62,48.12 v49.6,47.7 | U1.10 94.75,33.25 93.9,34.1 93.9,35.7 94.1,35.9 94.5,35.9 v94.9,36.3
  Bottom 0.406: v49.6,47.7 81,47.6 82,47.6 82.9,46.7 91.7,46.7 94.1,44.3 94.1,43.6 94,37 v94.9,36.3
  Bottom 0.5: v49.62,52.88 47.62,54.88 39.22,54.88 38.22,55.88 38.22,59.08 35.62,61.68 35.62,62.88 34.22,64.08 v34.22,67.08
DIR_Z  (via drill 0.5 pad 0.25)
  Top 0.406: v66.24,67.08 66.24,67.68 66.3,67.74 66.3,68.6 67.7,70 71.2,70 72.2,69 75.7,69 76.64,68.06 IC4.41 | v81.64,52.88 81.64,49.14 v81.9,48.7 | U1.11 96.23,34.1 95.1,34.1 94.9,34.3 v94.9,34.8
  Bottom 0.406: v81.9,48.7 92.1,48.7 95.9,44.9 95.9,43.6 95.8,35.6 v94.9,34.8
  Bottom 0.5: v81.64,52.88 79.64,54.88 71.24,54.88 70.24,55.88 70.24,59.08 67.64,61.68 67.64,62.88 66.24,64.08 v66.24,67.08
DTR  (1 unrouted)
  Top 0.406: 81.7,25.8 81.7,29.3 82.1,29.7 C27.2
ENABLE  (via drill 0.5 pad 0.25)
  Top 0.406: IC1.19 15.8,53.8 16.4,53.2 v16.4,48.7 | IC2.19 47.82,48.68 v48.3,48.7 | IC4.19 79.84,49.04 v80.2,48.7
  Bottom 0.406: v80.2,48.7 v48.3,48.7 v16.4,48.7
GND  (via drill 0.5 pad 0.25, 3.2 pad 6.45)  (37 unrouted)
  Top 0.305: IC1.44 IC1.43 11,66.08 11.2,65.88 14,65.88 14.2,66.08 IC1.39 | IC2.44 IC2.43 43.02,66.08 43.22,65.88 46.02,65.88 46.22,66.08 IC2.39 | IC4.44 IC4.43 75.04,66.08 75.24,65.88 78.04,65.88 78.24,66.08 IC4.39 | C31.1 94.9,44.1 93.5,42.7 92.6,42.7 91.6,43.7 89.2,43.7 88.8,43.3 v88.8,42.7
  Top 0.406: v11.4,29 v12.7,27.7 v11.4,27.7 | v11.4,27.7 v11.4,29 | v11.4,29 v12.7,29 | v7.4,29 v8.7,29 v10.1,29 v11.4,29 | v7.4,27.7 v8.7,27.7 v10.1,27.7 v11.4,27.7 | v11.4,29 v14.1,29 v14.1,27.7 | v15.5,27.7 v15.5,29 v16.9,29 v16.9,27.7 | 66.35,52.45 66.2,52.6 | 66.2,53.82 C43.2 | 91.2,53.3 v91.3,53.4 | 88.4,22.2 C23.1 C24.1 | 35.9,52.3 35.5,51.9 35.5,48.7 36.6,47.6 42.2,47.6 44.9,50.3 45.5,50.3 46.22,51.02 IC2.17 | U1.21 92.09,40.51 90.9,41.7 89.2,41.7 88.8,42.1 v88.8,42.7 | U1.5 92.89,29.89 92.4,29.4 91.5,29.4 91.3,29.6 | 91.3,29.6 91.3,30.95 U1.3 | v85.8,30.9 85.8,30.3 86.5,29.6 91.3,29.6 | IC1.17 14.2,52.8 14.6,52.4 14.6,49.9 13,48.3 9.2,48.3 8.6,47.7 4.3,47.7 3.4,48.6 3.4,51.7 | 3.4,51.7 3.7,52 4.8,52 v4.9,52.1 | IC4.17 78.24,51.54 75.1,48.4 73.5,48.4 72.9,47.8 68.7,47.8 67.5,49 67.5,52.2 67.4,52.3 | C13.2 2.1,52.1 2.4,51.8 3.3,51.8 3.4,51.7 | v2,55.1 2,56.86 R6.1 | v2.1,58.5 2.1,59.3 2.6,59.8 v3.6,59.8 | C21.2 34.12,56.76 R8.1 | v33.8,58.5 33.8,59.1 34.5,59.8 v35.9,59.8 | v24.5,60.2 25.2,60.2 25.9,59.5 25.9,58.8 26.6,58.1 26.6,57.1 R5.1 | v27.2,54.3 27.5,54.3 28.2,55 v28.2,56.7 | v56.6,60.1 57.2,60.1 v58.7,58.6 | 58.74,54.3 58.74,56.98 R7.1 | 65.72,54.3 65.72,56.98 R18.1 | v65.8,58.5 65.8,58.7 66.9,59.8 v67.8,59.8 | C44.2 90.34,56.76 R17.1 90.7,57.12 90.7,58.2 88.9,60 v88.5,60
  Top 0.5: IC1.39 14.2,67.68 14.6,68.08 16.2,68.08 16.4,68.28 16.4,69.38 C6.1 | C10.1 16.9,69.88 C6.1 | C1.2 16.54,69.52 C6.1 | IC2.39 46.22,67.68 46.62,68.08 48.22,68.08 48.42,68.28 48.42,69.38 C4.1 | C17.1 48.92,69.88 C4.1 | C18.2 48.56,69.52 C4.1 | IC4.39 78.24,67.68 78.64,68.08 80.24,68.08 80.44,68.28 80.44,69.38 C34.1 | C39.1 80.94,69.88 C34.1 | C40.2 80.58,69.52 C34.1
  Top 0.61: C40.2 80.58,72.82 80,73.4 76.6,73.4 76.1,72.9 76.1,71.8 76,71.7 70.32,71.7 C35.- | C18.2 48.56,72.94 48,73.5 44.3,73.5 44,73.2 44,70.7 43.6,70.3 41.2,70.3 39.4,72.1 37.92,72.1 C5.- | C3.- 7.46,72.14 9.6,70 11.4,70 11.8,70.4 11.8,73.2 12.2,73.6 16,73.6 16.6,73 16.6,71.94 C1.2 | v88.14,82.26 88.1,82.3 87.6,82.3 | 87.6,82.3 v56,82.3 v24.5,82.3 | v88.14,82.26 87.64,82.26 87.6,82.3 | v88.14,82.26 93.56,82.26 94.1,82.8 95.8,82.8 96.5,83.5 v96.5,86.5
  Top 1.016: IC3.3 IC3.6 15.5,28.84 IC3.5 | 66.2,52.6 66.2,53.82 | R8.1 v33.8,58.5 | C14.2 36.18,60.08 v35.9,59.8 | R6.1 1.78,58.18 v2.1,58.5 | C8.2 3.88,60.08 v3.6,59.8 | C13.2 2.1,55 v2,55.1 | v4.9,52.1 5.15,52.1 C7.2 | R5.1 27.82,57.08 v28.2,56.7 | C12.2 26.78,53.88 v27.2,54.3 | C21.2 33.64,53.4 v33.2,53.4 34.3,52.3 35.9,52.3 37.5,52.3 37.92,51.88 C19.2 | C41.2 69.94,51.86 69.5,52.3 67.4,52.3 66.5,52.3 66.35,52.45 | v65.2,54.3 65.72,54.3 C43.2 | v59.2,54.3 58.74,54.3 C22.2 | 91.2,53.3 90.92,53.3 C44.2 | v91.9,56.7 91.04,56.7 R17.1 | v58.7,58.6 58.7,57.14 R7.1 | v65.8,58.5 65.8,57.1 R18.1 | C36.2 68.08,60.08 v67.8,59.8 | C16.1 56.58,60.08 v56.6,60.1 | C38.1 88.42,60.08 v88.5,60 | v24.5,60.2 23.59,60.2 C9.1
  Top 1.27: IC3.3 12.1,28.4 v12.7,29 | IC3.5 v15.5,29
  Bottom 0.406: v88.8,42.7 88.5,42.7
  Bottom 0.61: C35.- 67.84,72.14 v67.8,72.1 | JP7.1 v88.14,82.26 | JP1.1 24.6,82.2 v24.5,82.3 | JP4.1 56.02,82.28 v56,82.3
  other vias: 3.5,86.5 96.5,3.5 36.2,72.2 4.2,72.2 3.5,3.5
GRBL_RX  (1 unrouted)
  Top 0.406: U1.30 86.15,34.05 85.8,33.7 85.4,33.7 83.8,32.1 83.8,30.1 82.5,28.8 82.5,24.8
GRBL_TX  (1 unrouted)
  Top 0.406: U1.31 86.55,33.25 86.1,32.8 85.6,32.8 84.6,31.8 84.6,29.7 83.3,28.4 83.3,25.3
MISO  (via drill 0.5 pad 0.25)
  Top 0.406: R3.2 37.07,48.93 36.6,49.4 v36.6,50.7 | R16.2 69.07,48.93 68.6,49.4 v68.6,50.7 | U1.16 96.83,38.1 97.3,38.1 v98.5,39.6
  Top 0.61: R1.2 4.97,48.93 4.6,49.3 v4.6,50.7
  Bottom 0.406: v4.6,50.7 v36.6,50.7 v68.6,50.7 89,50.6 92.6,50.6 97.6,45.6 97.6,40.5 v98.5,39.6
MOSI  (via drill 0.5 pad 0.25)
  Top 0.406: IC1.15 12.6,52.6 12.2,52.2 v12.2,49.7 | IC2.15 44.62,53.12 42.5,51 v42.5,49.7 | v74.7,49.7 74.7,51.3 76.64,53.24 IC4.15 | U1.15 96.83,37.3 97.6,37.3 v98.5,38.2
  Bottom 0.406: v12.2,49.7 v42.5,49.7 v74.7,49.7 92.3,49.7 96.8,45.2 96.8,41.73 96.78,39.45 96.78,39.22 97.8,38.2 v98.5,38.2
N$1
  Top 0.5: IC1.22 18.2,54.68 19,53.88 R4.2
N$2
  Top 0.5: IC1.25 21,58.48 R5.2
  pour Top (isolate 0.305, rank 3, no thermals): 19.4,58.88 20.6,58.88 20.8,59.08 25.2,59.08 25.2,52.88 21.4,52.88 21.4,54.68 21,55.08 21,57.88 20.8,58.08 19.4,58.08
N$3
  Top 0.5: IC1.9 7.4,58.48 R6.2
  pour Top (isolate 0.305, rank 3, no thermals): 3.2,59.08 9,59.08 9,58.08 7.8,58.08 7.6,57.88 7.6,55.28 7,54.68 7,52.88 3.2,52.88
N$4
  Top 0.5: IC1.12 10.2,54.68 9.4,53.88 R2.2
N$5
  Top 0.5: IC2.25 53.02,58.48 R7.2
  pour Top (isolate 0.305, rank 3, no thermals): 51.42,58.88 52.62,58.88 52.82,59.08 57.22,59.08 57.22,52.88 53.42,52.88 53.42,54.68 53.02,55.08 53.02,57.88 52.82,58.08 51.42,58.08
N$6
  Top 0.5: IC2.9 39.42,58.48 R8.2
  pour Top (isolate 0.305, rank 3, no thermals): 35.22,59.08 41.02,59.08 41.02,58.08 39.82,58.08 39.62,57.88 39.62,55.28 39.02,54.68 39.02,52.88 35.22,52.88
N$7
  Top 0.5: IC2.22 50.22,54.68 51.92,54.68 R9.2
N$8
  Top 0.5: IC2.12 42.22,54.68 41.42,53.88 R10.2
N$9
  Top 0.5: IC4.25 85.04,58.48 R17.2
  pour Top (isolate 0.305, rank 3, no thermals): 83.44,58.88 84.64,58.88 84.84,59.08 89.24,59.08 89.24,52.88 85.44,52.88 85.44,54.68 85.04,55.08 85.04,57.88 84.84,58.08 83.44,58.08
N$10
  Top 0.5: IC4.9 71.44,58.48 R18.2
  pour Top (isolate 0.305, rank 3, no thermals): 67.24,59.08 73.04,59.08 73.04,58.08 71.84,58.08 71.64,57.88 71.64,55.28 71.04,54.68 71.04,52.88 67.24,52.88
N$11
  Top 0.5: IC4.22 82.24,54.68 83.64,54.68 R19.2
N$12
  Top 0.5: IC4.12 74.24,54.68 73.44,53.88 R20.2
N$13
  Top 0.406: U1.7 94.49,28.49 94,28 93,28 92.7,27.7 92.7,26.7 92.5,26.5 87.1,26.5 | 87.1,26.5 86.53,26.5 Q1.2 | C23.2 87,26.4 87.1,26.5
N$14
  Top 0.406: U1.8 95.29,27.4 95.44,27.24 95.49,27.21 Q1.1 95.9,26.41 C24.2
N$15
  Top 0.813: JP1.2 30.1,78 D2.C
N$16
  Top 0.813: JP4.2 61.5,78 D3.C
N$17  (2 unrouted)
N$18
  Top 0.813: JP7.2 93,78 D5.C
N$19  (2 unrouted)
N$45  (2 unrouted)
N$47  (1 unrouted)
OA1  (via drill 0.5 pad 0.25)
  other vias: 9.4,63.68 10.2,63.68 9.4,62.88 10.2,62.88
  pour Top (isolate 0.305, rank 2, no thermals): 7.8,59.08 13.9,59.08 13.9,64.08 7.8,64.08 7.8,63.08 9,63.08 9,62.28 12.2,62.28 12.2,60.08 7.8,60.08
  pour Bottom (rank 2, no thermals): 10.6,62.48 10.6,64.08 9.6,65.08 9.6,80.28 5.4,80.28 5.4,62.28 7.2,60.48 7.4,60.48 7.4,62.48
OA2  (via drill 0.5 pad 0.25)
  other vias: 10.4,61.68 11.4,61.68 11.4,60.68 10.4,60.68 10.6,57.68 11.4,57.68 11.4,56.88 10.6,56.88 9.8,56.88
  pour Bottom (no thermals): 13.9,56.48 8,56.48 8,58.08 9,58.08 9,60.48 8,60.48 8,61.88 11.2,61.88 11.2,64.28 10.2,65.28 10.2,80.28 13.9,80.28
  pour Top (rank 3, no thermals): 7.8,60.48 11.8,60.48 11.8,61.88 7.8,61.88
  pour Top (no thermals): 8,57.68 9.2,57.68 9.2,58.48 13.9,58.48 13.9,56.48 8,56.48
OA3  (via drill 0.5 pad 0.25)
  other vias: 41.42,63.68 42.22,63.68 41.42,62.88 42.22,62.88
  pour Top (isolate 0.305, rank 2, no thermals): 39.82,59.08 45.92,59.08 45.92,64.08 39.82,64.08 39.82,63.08 41.02,63.08 41.02,62.28 44.22,62.28 44.22,60.08 39.82,60.08
  pour Bottom (rank 2, no thermals): 42.62,62.48 42.62,64.08 41.62,65.08 41.62,80.28 37.42,80.28 37.42,62.28 39.22,60.48 39.42,60.48 39.42,62.48
OA4  (via drill 0.5 pad 0.25)
  other vias: 42.42,61.68 43.42,61.68 43.42,60.68 42.42,60.68 42.62,57.68 43.42,57.68 43.42,56.88 42.62,56.88 41.82,56.88
  pour Bottom (no thermals): 45.92,56.48 40.02,56.48 40.02,58.08 41.02,58.08 41.02,60.48 40.02,60.48 40.02,61.88 43.22,61.88 43.22,64.28 42.22,65.28 42.22,80.28 45.92,80.28
  pour Top (rank 3, no thermals): 39.82,60.48 43.82,60.48 43.82,61.88 39.82,61.88
  pour Top (no thermals): 40.02,57.68 41.22,57.68 41.22,58.48 45.92,58.48 45.92,56.48 40.02,56.48
OA5  (via drill 0.5 pad 0.25)
  other vias: 73.44,63.68 74.24,63.68 73.44,62.88 74.24,62.88
  pour Top (isolate 0.305, rank 2, no thermals): 71.84,59.08 77.94,59.08 77.94,64.08 71.84,64.08 71.84,63.08 73.04,63.08 73.04,62.28 76.24,62.28 76.24,60.08 71.84,60.08
  pour Bottom (rank 2, no thermals): 74.64,62.48 74.64,64.08 73.64,65.08 73.64,80.28 69.44,80.28 69.44,62.28 71.24,60.48 71.44,60.48 71.44,62.48
OA6  (via drill 0.5 pad 0.25)
  other vias: 74.44,61.68 75.44,61.68 75.44,60.68 74.44,60.68 74.64,57.68 75.44,57.68 75.44,56.88 74.64,56.88 73.84,56.88
  pour Bottom (no thermals): 77.94,56.48 72.04,56.48 72.04,58.08 73.04,58.08 73.04,60.48 72.04,60.48 72.04,61.88 75.24,61.88 75.24,64.28 74.24,65.28 74.24,80.28 77.94,80.28
  pour Top (rank 3, no thermals): 71.84,60.48 75.84,60.48 75.84,61.88 71.84,61.88
  pour Top (no thermals): 72.04,57.68 73.24,57.68 73.24,58.48 77.94,58.48 77.94,56.48 72.04,56.48
OB1  (via drill 0.5 pad 0.25)
  other vias: 18.2,62.88 19,62.88 18.2,63.68 19,63.68
  pour Top (isolate 0.305, rank 2, no thermals): 14.5,59.08 20.6,59.08 20.6,60.08 16.2,60.08 16.2,62.28 19.4,62.28 19.4,63.08 20.6,63.08 20.6,64.08 14.5,64.08
  pour Bottom (rank 2, no thermals): 17.8,62.48 22.8,62.48 23,76.48 23,80.28 19,80.28 19,66.08 17.8,64.88
OB2  (via drill 0.5 pad 0.25)
  other vias: 17,57.68 17.8,57.68 17,56.88 17.8,56.88 17,60.68 18,60.68 17,61.68 18,61.68
  pour Bottom (no thermals): 14.5,56.48 14.5,80.28 18.4,80.28 18.4,66.28 17.2,65.08 17.2,61.88 20.6,61.88 20.6,60.48 19.4,60.48 19.4,58.08 20.6,58.08 20.6,56.48
  pour Top (no thermals): 20.6,57.88 19.2,57.88 19.2,58.48 14.5,58.48 14.5,56.48 20.6,56.48
  pour Top (rank 3, no thermals): 16.6,60.48 20.6,60.48 20.6,61.88 16.6,61.88
OB3  (via drill 0.5 pad 0.25)
  other vias: 49.02,57.68 49.82,57.68 49.02,56.88 49.82,56.88 49.02,60.68 50.02,60.68 49.02,61.68 50.02,61.68
  pour Bottom (no thermals): 46.52,56.48 46.52,80.28 50.42,80.28 50.42,66.28 49.22,65.08 49.22,61.88 52.62,61.88 52.62,60.48 51.42,60.48 51.42,58.08 52.62,58.08 52.62,56.48
  pour Top (no thermals): 52.62,57.88 51.22,57.88 51.22,58.48 46.52,58.48 46.52,56.48 52.62,56.48
  pour Top (rank 3, no thermals): 48.62,60.48 52.62,60.48 52.62,61.88 48.62,61.88
OB4  (via drill 0.5 pad 0.25)
  other vias: 50.22,62.88 51.02,62.88 50.22,63.68 51.02,63.68
  pour Top (isolate 0.305, rank 2, no thermals): 46.52,59.08 52.62,59.08 52.62,60.08 48.22,60.08 48.22,62.28 51.42,62.28 51.42,63.08 52.62,63.08 52.62,64.08 46.52,64.08
  pour Bottom (rank 2, no thermals): 49.82,62.48 54.82,62.48 55.02,76.48 55.02,80.28 51.02,80.28 51.02,66.08 49.82,64.88
OB5  (via drill 0.5 pad 0.25)
  other vias: 81.04,57.68 81.84,57.68 81.04,56.88 81.84,56.88 81.04,60.68 82.04,60.68 81.04,61.68 82.04,61.68
  pour Bottom (no thermals): 78.54,56.48 78.54,80.28 82.44,80.28 82.44,66.28 81.24,65.08 81.24,61.88 84.64,61.88 84.64,60.48 83.44,60.48 83.44,58.08 84.64,58.08 84.64,56.48
  pour Top (no thermals): 84.64,57.88 83.24,57.88 83.24,58.48 78.54,58.48 78.54,56.48 84.64,56.48
  pour Top (rank 3, no thermals): 80.64,60.48 84.64,60.48 84.64,61.88 80.64,61.88
OB6  (via drill 0.5 pad 0.25)
  other vias: 82.24,62.88 83.04,62.88 82.24,63.68 83.04,63.68
  pour Top (isolate 0.305, rank 2, no thermals): 78.54,59.08 84.64,59.08 84.64,60.08 80.24,60.08 80.24,62.28 83.44,62.28 83.44,63.08 84.64,63.08 84.64,64.08 78.54,64.08
  pour Bottom (rank 2, no thermals): 81.84,62.48 86.84,62.48 87.04,76.48 87.04,80.28 83.04,80.28 83.04,66.08 81.84,64.88
PWR_X
  pour Top (isolate 0.305, no thermals): 7.4,65.48 7.4,62.68 8.6,62.68 8.6,62.28 7.4,62.28 7.4,59.68 5.8,59.68 5.8,61.08 4.2,61.08 4.2,66.88 9.6,66.88 9.6,66.08 16.4,66.08 16.4,67.08 16.8,67.08 16.8,66.08 18.8,66.08 18.8,70.48 25.1,67.98 25,64.28 32.72,61.98 33,62 33,59.5 29.8,59.5 29.8,59.68 21,59.68 21,62.28 19.8,62.28 19.8,62.68 21,62.68 21,65.48 19.4,65.48 19.4,64.48 9,64.48 9,65.48
PWR_Y
  pour Top (isolate 0.305, no thermals): 39.42,65.48 39.42,62.68 40.62,62.68 40.62,62.28 39.42,62.28 39.42,59.68 37.82,59.68 37.82,61.08 36.22,61.08 36.22,66.88 41.62,66.88 41.62,66.08 48.42,66.08 48.42,67.08 48.82,67.08 48.82,66.08 50.82,66.08 50.82,70.48 57.32,67.98 57.32,64.58 64.72,62.08 65.1,62.1 65,59.7 62,59.7 62.02,59.78 60.62,59.78 53.02,59.68 53.02,62.28 51.82,62.28 51.82,62.68 53.02,62.68 53.02,65.48 51.42,65.48 51.42,64.48 41.02,64.48 41.02,65.48
PWR_Z
  pour Top (isolate 0.305, no thermals): 71.44,65.48 71.44,62.68 72.64,62.68 72.64,62.28 71.44,62.28 71.44,59.68 69.84,59.68 69.84,61.08 68.24,61.08 68.24,66.88 73.64,66.88 73.64,66.08 80.44,66.08 80.44,67.08 80.84,67.08 80.84,66.08 82.84,66.08 82.84,70.48 89.34,67.68 89.34,64.78 96.82,61.98 96.8,61.9 96.8,59.5 93.7,59.5 93.54,59.68 85.04,59.68 85.04,62.28 83.84,62.28 83.84,62.68 85.04,62.68 85.04,65.48 83.44,65.48 83.44,64.48 73.04,64.48 73.04,65.48
RESET_GRBL  (2 unrouted)
  Top 0.406: U1.29 85.65,34.85 85.3,34.5 82.2,34.5 C27.1 R11.1
SCK  (via drill 0.5 pad 0.25)
  Top 0.406: IC1.16 13.4,52.3 13.6,52.1 v13.6,51.7 | IC4.16 77.44,52.54 v76.6,51.7 | IC2.16 45.42,52.12 v44.9,51.6 | U1.17 95.29,40.49 95.7,40.9 98.8,40.9 98.9,41 v99.1,41
  Bottom 0.406: v13.6,51.7 v44.9,51.6 v76.6,51.7 92.7,51.7 98.5,45.9 98.5,42 99.1,41.4 v99.1,41
SDO_X
  Top 0.5: IC2.14 43.82,53.68 41.22,51.08 41.22,49.68 40.62,49.08 39.95,49.08 R3.1
SDO_Y
  Top 0.5: IC1.14 11.8,53.68 9.2,51.08 9.2,49.68 8.6,49.08 7.93,49.08 R1.1
SDO_Z
  Top 0.5: IC4.14 75.84,53.68 73.24,51.08 73.24,49.68 72.64,49.08 71.97,49.08 R16.1
SPIN-PWM  (via drill 0.5 pad 0.25)  (1 unrouted)
  Top 0.406: U1.13 98.25,35.65 v98.5,35.4
  Bottom 0.406: 80.9,28.1 88.6,28.1 90.4,29.9 92.15,29.9 97.9,35.65 98.35,35.65 v98.5,35.4
SPINDLE-DIR/EN  (via drill 0.5 pad 0.25)  (1 unrouted)
  Top 0.406: U1.12 97.65,34.85 v98.5,34
  Bottom 0.406: 81.4,27.3 88.9,27.3 90.8,29.2 92.5,29.2 97.3,34 v98.5,34
STEP_X  (via drill 0.5 pad 0.25)
  Top 0.406: IC1.42 11.8,67.4 11.2,68 8.6,68 7.3,69.3 4.7,69.3 4,68.6 v4,68.58 | v19,52.88 v19,46.7 | v87.7,30.9 87.6,30.9 87.1,31.4 87.1,32 87.45,32.35 88,32.35 U1.32
  Bottom 0.406: v19,46.7 47.4,46.7 49.4,44.7 80.4,44.7 81.4,43.7 90.7,43.7 91.3,43.1 91.3,32.7 90.9,32.3 89.1,32.3 v87.7,30.9
  Bottom 0.5: v4,68.58 4,64.18 4.6,63.38 4.6,62.08 7.2,59.48 7.2,56.08 7.6,55.68 16.2,55.68 v19,52.88
STEP_Y  (via drill 0.5 pad 0.25)
  Top 0.406: IC2.42 43.82,67.48 43.2,68.1 40.4,68.1 39.4,69.1 36.4,69.1 35.6,68.3 35.6,67.26 v35.42,67.08 | v51.02,52.88 51.02,47.12 51,47 v51,46.7 | U1.1 89.7,32.2 90.7,33.2 90.7,36.7 91.7,37.7 92.9,37.7 v93.1,37.9
  Bottom 0.406: v51,46.7 81.4,46.7 82.4,45.7 91.5,45.7 93.1,44.1 v93.1,37.9
  Bottom 0.5: v35.42,67.08 35.42,64.48 36.62,63.28 36.62,62.08 39.22,59.48 39.22,56.08 39.62,55.68 48.22,55.68 v51.02,52.88
STEP_Z  (via drill 0.5 pad 0.25)
  Top 0.406: 67.44,67.48 v67.44,67.08 67.5,67.14 67.5,68.5 68.1,69.1 70.8,69.1 71.7,68.2 75.3,68.2 75.84,67.66 IC4.42 | U1.2 90.5,31.9 91.5,32.9 91.5,36.2 92,36.7 93.7,36.7 v94.9,37.9 | v83.04,52.88 83.04,48.26 v83.4,47.7
  Bottom 0.406: v94.9,37.9 95,43.6 95,44.6 91.9,47.7 v83.4,47.7
  Bottom 0.5: v67.44,67.08 67.44,64.48 68.64,63.28 68.64,62.08 71.24,59.48 71.24,56.08 71.64,55.68 80.24,55.68 v83.04,52.88
V+  (via drill 0.5 pad 0.25)  (6 unrouted)
  other vias: 30.2,68.9 31.1,68.9 32,68.9 32.9,68.9 61.9,69.1 62.8,69.1 63.7,69.1 64.6,69.1 94,68.9 94.9,68.9 95.8,68.9 96.7,68.9 96.7,69.9 95.8,69.9 94.9,69.9 94,69.9 64.6,70 63.7,70 62.8,70 61.9,70 30.2,69.8 31.1,69.8 32,69.8 32.9,69.8
  pour Top (rank 5, no thermals): 29.6,65.6 29.6,70.4 33.2,70.4 33.2,65.6
  pour Top (rank 5, no thermals): 61.5,66 61.5,70.4 65.2,70.4 65.2,66
  pour Top (rank 5, no thermals): 93.4,70.4 93.4,65.7 97.2,65.7 97.2,70.4
VCC  (via drill 0.5 pad 0.25)  (7 unrouted)
  Top 0.406: v92.5,33.1 92.5,32.5 | 92.5,32.5 92.1,32.1 U1.4 | 92.5,32.5 92.7,32.3 93.5,32.3 93.69,32.11 U1.6 93.7,30.95 93.7,29.4 93.5,29.2 v93.5,29 | U1.18 94.49,40.99 95.3,41.8 98,41.8 98.5,42.3 98.5,43.7 | 98.5,43.7 C31.2 | R11.2 79.2,31.28 v79.2,30 77.3,30 76.9,30.4 C25.2 | U$4.16 | 98.5,43.7 98.5,55.4 98.9,55.8 98.9,71.5 R15.1 | R13.1 64.5,72.4 | 65.8,80.8 66.1,81.1 | R12.1 32.9,72.4
  Top 0.61: R15.1 97.3,73.5 98,74.2 98,81.1 66.1,81.1 34.5,81.1 34.2,80.8 34.2,73.7 32.9,72.4 | 64.5,72.4 65.8,73.7 65.8,80.8
  Top 0.813: R15.1 97.5,73.1
  Bottom 0.406: v92.5,33.1 92.5,32.5 91.3,31.3 89.5,31.3 87.9,29.7 79.5,29.7 v79.2,30 | 93.6,29 v93.5,29
VHS
  Top 0.5: IC1.35 17.4,67.36 C11.1
VHS1
  Top 0.5: IC2.35 49.42,67.36 C15.1
VHS2
  Top 0.5: IC4.35 81.44,67.36 C37.1
VREG
  Top 0.5: IC1.13 11,54.25 C7.1
VREG1
  Top 0.5: IC2.13 43.02,54.25 C19.1
VREG2
  Top 0.5: IC4.13 75.04,54.25 C41.1
X-END  (via drill 0.5 pad 0.25)
  Top 0.406: U1.26 85.35,37.25 v83.9,38.7 | v21,53 21,48.7 v24.9,44.8
  Top 0.61: R12.2 29.7,75.8 29.6,75.9 | v23.7,74.3 23.7,75.4 24.2,75.9 29.6,75.9 | 29.6,75.9 31.6,75.9 D2.A
  Bottom 0.406: v24.9,44.8 44.7,44.7 48.7,40.7 74.4,40.7 75.4,39.7 78.2,39.7 79.2,38.7 v83.9,38.7 | v23.7,74.3 23.7,68.2 24.5,67.4 24.5,65.6 23.6,64.7 23.6,62.1 23.3,61.8 21.6,61.8 21.3,61.5 21.3,53.3 v21,53
Y-END  (via drill 0.5 pad 0.25)
  Top 0.406: U1.27 84.65,36.45 v83.9,37.2 | v52.5,52.9 52.5,44.8 v49.4,41.7
  Top 0.61: R13.2 61.6,75.3 61.9,75.6 D3.A 56,75.6 55.8,75.4 v55.8,75.2
  Bottom 0.406: 84.1,37.2 v83.9,37.2 84.5,37.2 85,37.7 85,39.2 84.5,39.7 79.5,39.7 78.5,40.7 75.8,40.7 74.8,41.7 v49.4,41.7 | v55.8,75.2 55.8,68.1 56.6,67.3 56.6,65.6 55.7,64.7 55.7,62.2 55.2,61.7 53.9,61.7 53.5,61.3 53.5,56.1 53,55.6 52.8,55.6 52.5,55.3 v52.5,52.9
Z-END  (via drill 0.5 pad 0.25)
  Top 0.406: v93.3,73.1 R15.2 94.5,71.8 94.8,71.5 97.5,71.5 98.1,70.9 98.1,56.2 97.7,55.8 97.7,43.2 97.1,42.6 94.6,42.6 93.6,41.6 92.3,41.6 91.2,42.7 v90.2,42.7 | U1.28 89.65,35.65 89.8,35.8 89.8,37.3 v90.2,37.7
  Top 0.813: D5.A 96.1,75.7 95,75.7 94.5,75.2 R15.2
  Bottom 0.406: v90.2,37.7 v90.2,42.7

### Text on the board
TOPSILK: X | Y | Z | 10K | 10K | 10K | 47uF | 47uF | + | + | 47uF | + | + | + | + | 47uF | 47uF | 47uF | TMC2660-PA | TMC2660-PA | TMC2660-PA